# EAGLE design startum2 (EAGLE 8.3.2)
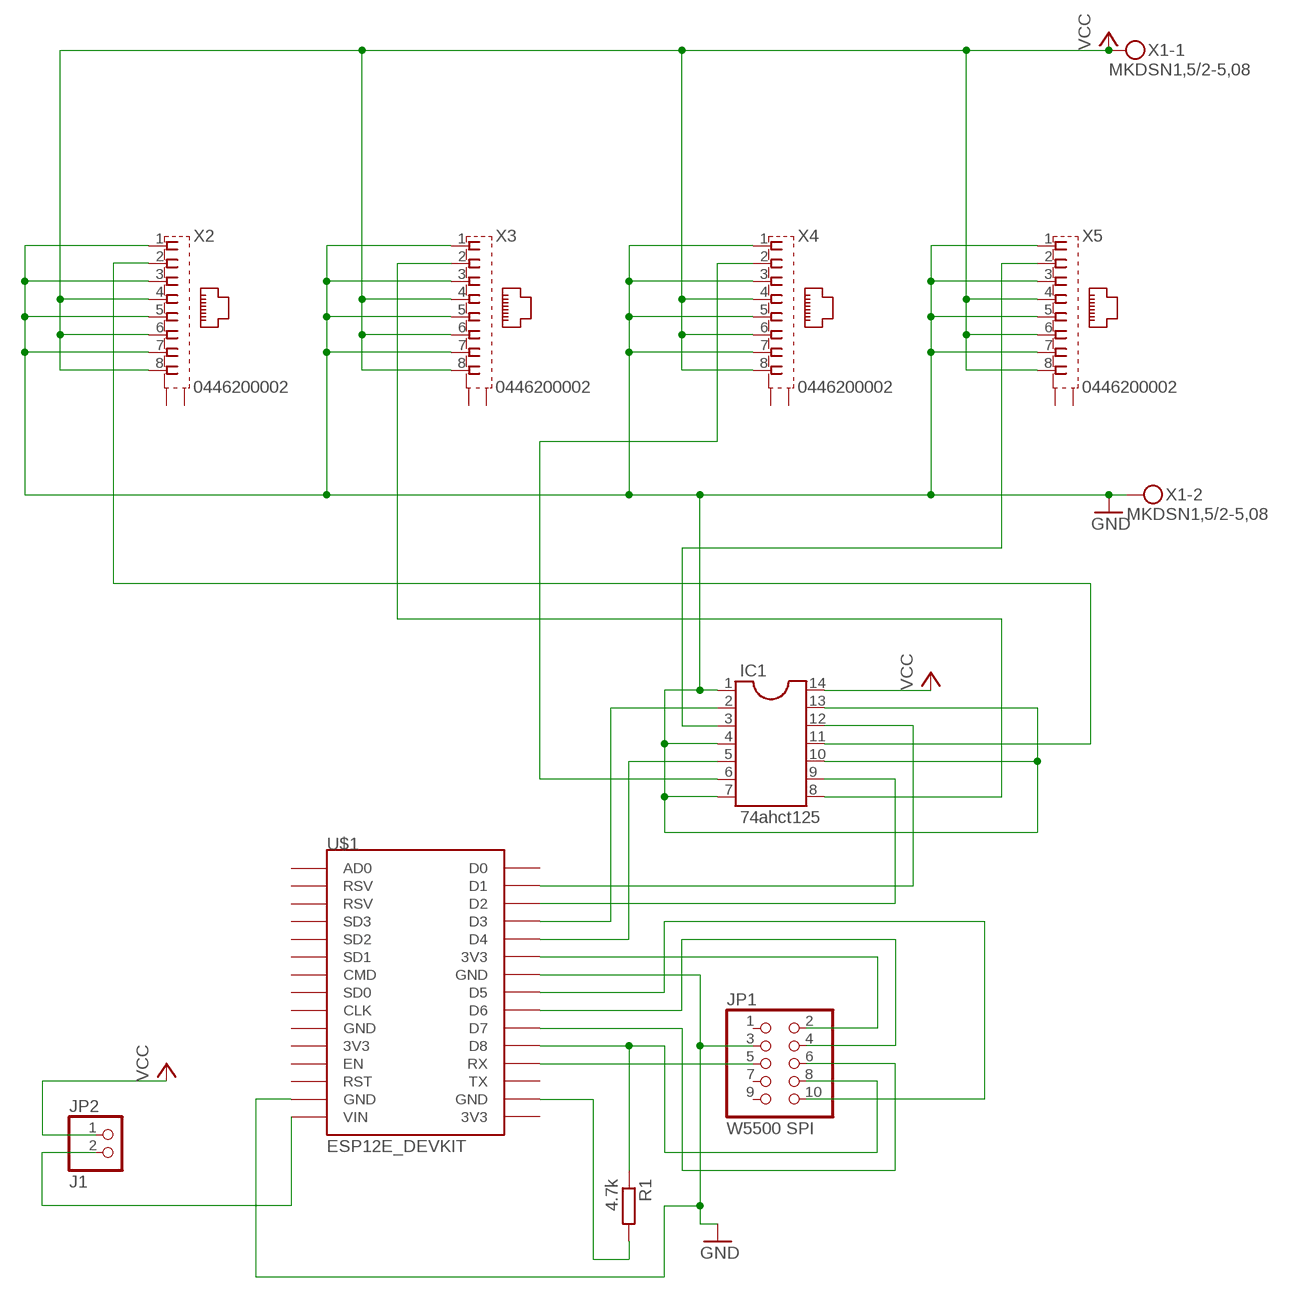
[diagram p0: schematic, sheet 1]

## Parts
IC1  74ahct125  DIL14  [DIL14]
JP1  W5500 SPI  PINHD-2X5  [2X05]
JP2  J1  PINHD-1X2  [1X02]
R1  4.7k  R-EU_0207/10  [0207/10]
U$1  ESP12E_DEVKIT  [ESP12E_DEVKIT]
X1  MKDSN1,5/2-5,08  [MKDSN1,5/2-5,08]
X2  0446200002  [0446200002]
X3  0446200002  [0446200002]
X4  0446200002  [0446200002]
X5  0446200002  [0446200002]

## Nets
GND: IC1.1 IC1.4 IC1.7 IC1.10 IC1.13 JP1.3 U$1.GND@1(GND) U$1.GND@2(GND) X1.2 X2.1 X2.3 X2.5 X2.7 X3.1 X3.3 X3.5 X3.7 X4.1 X4.3 X4.5 X4.7 X5.1 X5.3 X5.5 X5.7
N$1: JP1.2 U$1.3V3@1(3V3)
N$2: R1.2 U$1.GND@3(GND)
N$3: JP1.10 U$1.D5
N$4: JP1.4 U$1.D6
N$5: JP1.6 U$1.D7
N$6: JP1.8 R1.1 U$1.D8
N$7: JP1.5 U$1.RX
N$10: IC1.12 U$1.D1
N$11: IC1.9 U$1.D2
N$12: JP2.2 U$1.VIN
N$13: IC1.6 X4.2
N$14: IC1.2 U$1.D3
N$15: IC1.5 U$1.D4
N$16: IC1.8 X3.2
N$17: IC1.3 X5.2
N$19: IC1.11 X2.2
VCC: IC1.14 JP2.1 X1.1 X2.4 X2.6 X2.8 X3.4 X3.6 X3.8 X4.4 X4.6 X4.8 X5.4 X5.6 X5.8
Unconnected: JP1.1 JP1.7 JP1.9 U$1.3V3@0(3V3) U$1.3V3@2(3V3) U$1.AD0 U$1.CLK U$1.CMD U$1.D0 U$1.EN U$1.GND@0(GND) U$1.RST U$1.RSV@0(RSV) U$1.RSV@1(RSV) U$1.SD0 U$1.SD1 U$1.SD2 U$1.SD3 U$1.TX X2.S@1(S1) X2.S@2(S2) X3.S@1(S1) X3.S@2(S2) X4.S@1(S1) X4.S@2(S2) X5.S@1(S1) X5.S@2(S2)

## Library data of the parts
IC1 = ic-package:DIL14: Dual In Line / Socket; MF: TEXAS INSTRUMENT CONNECTORS; MPN: SN74AHCT125N; OC_NEWARK: 83F8892
JP1 = pinhead:PINHD-2X5: PIN HEADER; OC_NEWARK: unknown
JP2 = pinhead:PINHD-1X2: PIN HEADER
R1 = resistor:R-EU_: RESISTOR, European symbol; MPN: MCWF08P4701FTL; OC_NEWARK: 32AC7849
U$1 = ESP12E_DEVKIT:ESP12E_DEVKIT: ESP12E DEVKIT BOARD; OC_NEWARK: unknown
X1 = con-phoenix-508:MKDSN1,5/2-5,08: MKDSN 1,5/ 2-5,08 Printklemme Nennstrom: 13,5 A Nennspannung: 250 V Rastermaß: 5,08 mm Polzahl: 2 Anschlussart: Schraubanschluss Montage: Löten Anschlussrichtung Leiter/Platine: 0 ° Artikelnummer: 1729128 Source: http://eshop.phoenixcontact.com .. 1729128.pdf; OC_NEWARK: unknown
X2-X5 = con-molex:0446200002: RJ-45 INVERTED MODULAR JACK ASSEMBLY WITH RJ-11 KEEPOUT FEATURE Source: Data sheet <http://www.farnell.com/datasheets/73207.pdf> MOLEX 0446200002 BUCHSE, RJ45, GESCHIRMT Source: Farnell <http://de.farnell.com/molex/0446200002/buchse-rj45-geschirmt/dp/9251910?ost=9251910>; MF: FARNELL; MPN: 0446200002; OC_FARNELL: 9251910; OC_NEWARK: 38K9904

## Net classes
0 default: width 0.025 mm, clearance 0.025 mm
1 ground: width 4 mm, clearance 0.051 mm
2 vcc: width 4 mm, clearance 0.051 mm

## Board
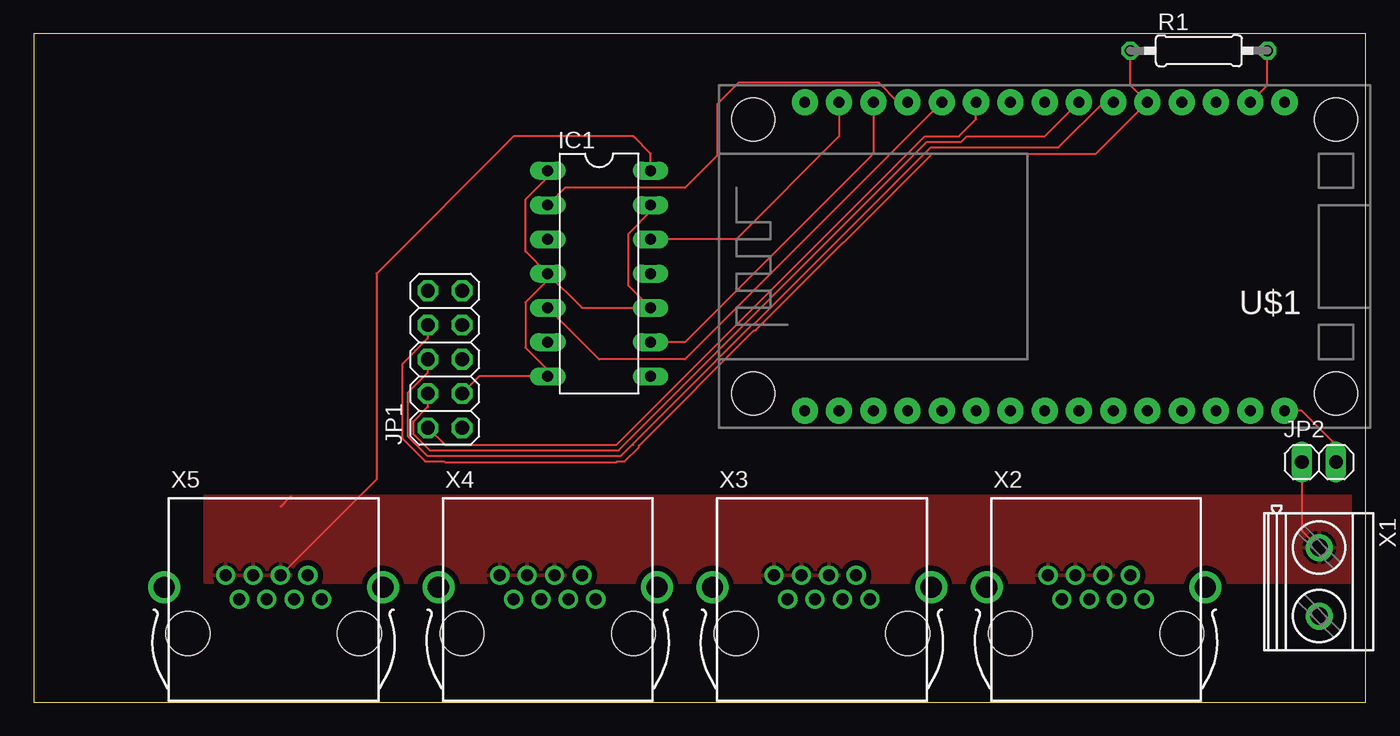
[diagram p1: board, top side]
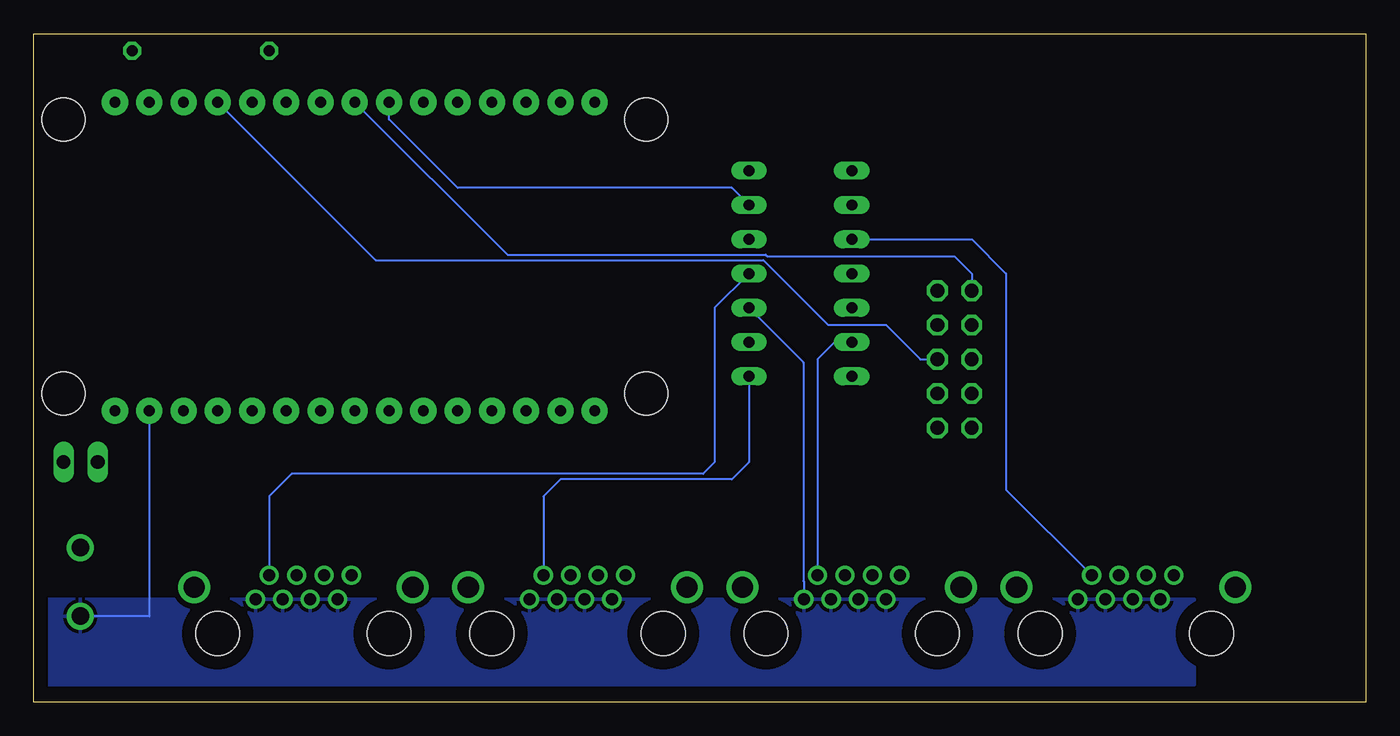
[diagram p2: board, bottom side, seen from below]

Size 98.73 x 49.52 mm. Coordinates in mm from the lower left corner, seen from the top.
Outline: 0,0 98.73,0 98.73,49.52 0,49.52 0,0
Copper layers (1*16): Top 0.035mm / dielectric 1.5mm / Bottom 0.035mm
Design rules "default *": minimum track width 10mil, minimum drill 0.35mm, track to track 10mil, track to pad 10mil, pad to pad 10mil, via to via 10mil, smd to smd 6mil, copper to edge 40mil, drill to drill 6mil, minimum pad ring 10mil, minimum via ring 8mil, stop-mask expansion 4mil, vias tented up to drill 0mil, thermal gap 10mil

### Footprints (pad centres in the part's own frame; a part is rotated, then mirrored left to right if it is on the bottom)
DIL14 = drill 0.813 long: 1 -7.62,-3.81; 2 -5.08,-3.81; 3 -2.54,-3.81; 4 0,-3.81; 5 2.54,-3.81; 6 5.08,-3.81; 7 7.62,-3.81; 8 7.62,3.81; 9 5.08,3.81; 10 2.54,3.81; 11 0,3.81; 12 -2.54,3.81; 13 -5.08,3.81; 14 -7.62,3.81
2X05 = drill 1.016 octagon: 1 -5.08,-1.27; 2 -5.08,1.27; 3 -2.54,-1.27; 4 -2.54,1.27; 5 0,-1.27; 6 0,1.27; 7 2.54,-1.27; 8 2.54,1.27; 9 5.08,-1.27; 10 5.08,1.27
1X02 = drill 1.016 long: 1 -1.27,0; 2 1.27,0
0207/10 = drill 0.813 octagon: 1 -5.08,0; 2 5.08,0
ESP12E_DEVKIT = drill 0.8 pad 1.93: 3V3@0 -11.43,-7.62; 3V3@1 11.43,5.08; 3V3@2 11.43,-17.78; AD0 -11.43,17.78; CLK -11.43,-2.54; CMD -11.43,2.54; D0 11.43,17.78; D1 11.43,15.24; D2 11.43,12.7; D3 11.43,10.16; D4 11.43,7.62; D5 11.43,0; D6 11.43,-2.54; D7 11.43,-5.08; D8 11.43,-7.62; EN -11.43,-10.16; GND@0 -11.43,-5.08; GND@1 -11.43,-15.24; GND@2 11.43,2.54; GND@3 11.43,-15.24; RST -11.43,-12.7; RSV@0 -11.43,15.24; RSV@1 -11.43,12.7; RX 11.43,-10.16; SD0 -11.43,0; SD1 -11.43,5.08; SD2 -11.43,7.62; SD3 -11.43,10.16; TX 11.43,-12.7; VIN -11.43,-17.78 | hole 3.2: -10.16,21.59; 10.16,21.59; 10.16,-21.59; -10.16,-21.59
MKDSN1,5/2-5,08 = drill 1.3 pad 2: 1 -2.561,0.025; 2 2.519,0.025
0446200002 = drill 0.889 pad 1.422: 1 3.556,2.54; 2 2.54,4.318; 3 1.524,2.54; 4 0.508,4.318; 5 -0.508,2.54; 6 -1.524,4.318; 7 -2.54,2.54; 8 -3.556,4.318 | drill 1.575 pad 2.286: S@1 -8.103,3.429; S@2 8.103,3.429 | hole 3.251: 6.35,0; -6.35,0

### Placement (x,y rotation side)
IC1  41.91,31.75 270 top
JP1  30.48,25.4 90 top
JP2  95.25,17.78 0 top
R1  86.36,48.26 0 top
U$1  74.93,33.02 90 top
X1  95.25,8.89 270 top
X2  78.74,5.08 0 top
X3  58.42,5.08 0 top
X4  38.1,5.08 0 top
X5  17.78,5.08 0 top

### Tracks (layer width: path | path; a pad name or v marks a point on that pad's centre or on a via)
GND
  Top 0.152: JP1.3 33.02,24.13 IC1.7 38.1,24.61 36.45,26.26 36.45,29.62 38.1,31.27 IC1.4 | IC1.4 40.64,29.21 IC1.10 44.07,30.86 44.07,34.7 45.72,36.35 IC1.13 | IC1.4 36.45,33.4 36.45,37.24 38.1,38.89 IC1.1
  Bottom 0.152: IC1.13 46.99,38.1 67.31,38.1 72.39,43.18 U$1.GND@2 | X4.1 41.66,8.94 41.68,8.97 41.68,25.17 IC1.10 | U$1.GND@1 90.17,6.35 95.25,6.35 X1.2
  pour Bottom (isolate 0.406): 97.79,7.62 12.7,7.62 12.7,1.27 97.79,1.27
N$1
  Top 0.152: JP1.2 30.48,19.05 43.18,19.05 66.04,41.91 68.58,41.91 69.85,43.18 U$1.3V3@1
N$2
  Top 0.152: U$1.GND@3 91.44,45.72 R1.2
N$3
  Bottom 0.152: U$1.D5 63.63,33.15 44.48,33.15 44.35,33.02 30.48,33.02 29.21,31.75 JP1.10
N$4
  Top 0.152: JP1.4 29.21,21.86 28.12,20.77 28.12,19.87 29.34,18.64 43.35,18.64 66.21,41.5 68.75,41.5 69.16,41.91 74.93,41.91 U$1.D6
N$5
  Top 0.152: JP1.6 29.21,24.41 27.71,22.91 27.71,19.7 29.17,18.24 43.52,18.24 44.33,19.05 44.45,19.05 44.39,19.11 53.22,27.94 53.34,27.94 66.5,41.1 75.95,41.1 79.3,44.45 U$1.D7
N$6
  Top 0.152: JP1.8 29.21,26.95 27.3,25.04 27.3,19.53 29,17.83 30.43,17.83 30.48,17.78 43.18,17.78 43.23,17.83 43.81,17.83 44.86,18.88 44.86,19 53.39,27.53 53.51,27.53 66.62,40.64 78.74,40.64 U$1.D8 81.28,45.72 R1.1
N$7
  Bottom 0.152: U$1.RX 73.38,32.74 44.65,32.74 39.85,27.94 35.56,27.94 33.02,25.4 JP1.5
N$10
  Top 0.152: U$1.D1 59.69,41.91 52.07,34.29 IC1.12
N$11
  Top 0.152: U$1.D2 62.23,40.64 48.26,26.67 IC1.9
N$12
  Top 0.152: JP2.2 96.52,19.05 93.98,21.59 U$1.VIN
N$13
  Bottom 0.152: IC1.6 39.37,26.67 40.64,25.4 X4.2
N$14
  Top 0.152: U$1.D3 64.06,44.45 62.64,45.87 52.22,45.87 50.65,44.3 50.65,40.49 48.26,38.1 39.37,38.1 IC1.2
N$15
  Top 0.152: U$1.D4 48.26,25.4 41.91,25.4 IC1.5
N$16
  Bottom 0.152: IC1.8 45.72,17.78 46.99,16.51 59.69,16.51 60.96,15.24 X3.2
N$17
  Bottom 0.152: IC1.3 29.21,34.29 26.67,31.75 26.67,15.75 X5.2
N$19
  Bottom 0.152: IC1.11 48.26,29.21 48.26,17.78 49.12,16.92 79.6,16.92 81.28,15.24 X2.2
VCC
  Top 0.152: 19.05,15.24 18.29,14.48 | JP2.1 93.98,12.7 95.23,11.45 X1.1 | IC1.14 45.72,40.64 44.45,41.91 35.56,41.91 25.4,31.75 25.4,16.51 X5.4
  pour Top (isolate 0.406): 12.7,15.24 12.7,8.89 99.06,8.89 99.06,15.24